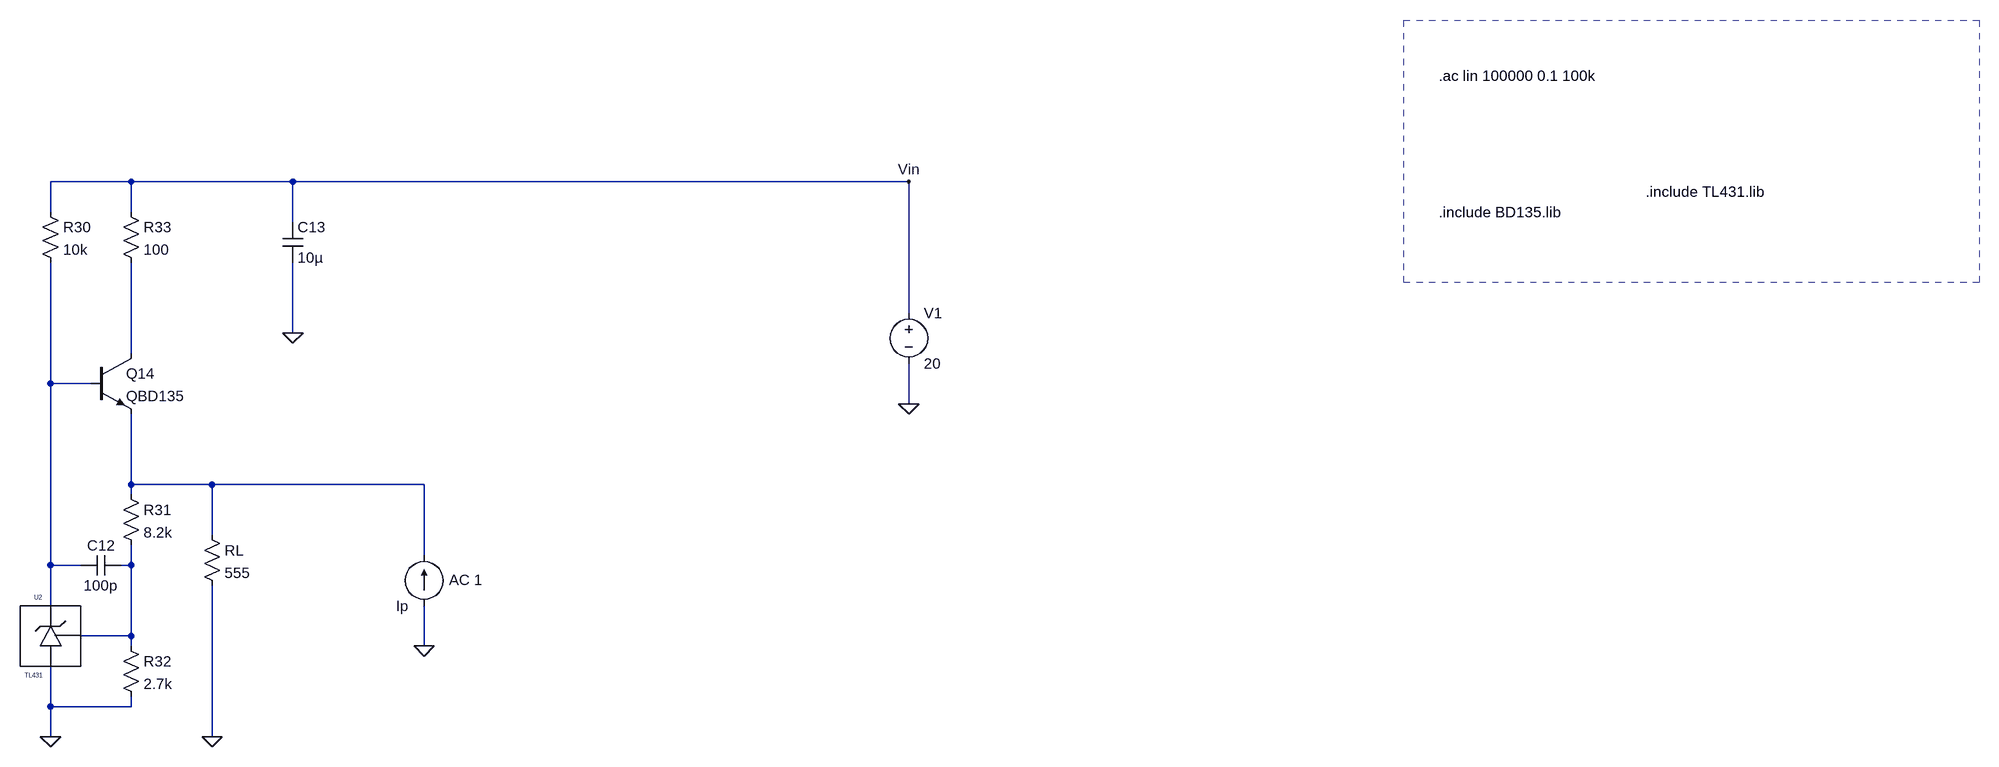
[diagram p0: schematic VREFERENCE_Ro.asc]
VREFERENCE_Ro.asc, the LTspice schematic file:
Version 4
SHEET 1 3040 1240
WIRE -1200 -752 -1328 -752
WIRE -944 -752 -1200 -752
WIRE 32 -752 -944 -752
WIRE -1328 -704 -1328 -752
WIRE -1200 -704 -1200 -752
WIRE -944 -688 -944 -752
WIRE 32 -544 32 -752
WIRE -944 -512 -944 -624
WIRE -1200 -480 -1200 -624
WIRE -1328 -432 -1328 -624
WIRE -1264 -432 -1328 -432
WIRE 32 -400 32 -464
WIRE -1200 -272 -1200 -384
WIRE -1072 -272 -1200 -272
WIRE -736 -272 -1072 -272
WIRE -1200 -256 -1200 -272
WIRE -1072 -192 -1072 -272
WIRE -736 -160 -736 -272
WIRE -1328 -144 -1328 -432
WIRE -1280 -144 -1328 -144
WIRE -1200 -144 -1200 -176
WIRE -1200 -144 -1216 -144
WIRE -1328 -80 -1328 -144
WIRE -1200 -32 -1200 -144
WIRE -1200 -32 -1280 -32
WIRE -1200 -16 -1200 -32
WIRE -736 -16 -736 -80
WIRE -1328 80 -1328 16
WIRE -1200 80 -1200 64
WIRE -1200 80 -1328 80
WIRE -1328 128 -1328 80
WIRE -1072 128 -1072 -112
FLAG -944 -512 0
FLAG -1328 128 0
FLAG -736 -16 0
FLAG 32 -400 0
FLAG 32 -752 Vin
FLAG -1072 128 0
DATAFLAG -1328 -432 ""
DATAFLAG -1200 -544 ""
DATAFLAG -1200 -304 "-Ie(Q14)"
DATAFLAG -1328 -224 "Ix(U2:CATHODE)"
DATAFLAG -960 -272 ""
SYMBOL cap -960 -688 R0
SYMATTR InstName C13
SYMATTR Value 10µ
SYMBOL res -1344 -720 R0
SYMATTR InstName R30
SYMATTR Value 10k
SYMBOL npn -1264 -480 R0
SYMATTR InstName Q14
SYMATTR Value QBD135
SYMBOL res -1216 -272 R0
SYMATTR InstName R31
SYMATTR Value 8.2k
SYMBOL res -1216 -32 R0
SYMATTR InstName R32
SYMATTR Value 2.7k
SYMBOL cap -1216 -160 R90
WINDOW 0 0 32 VBottom 2
WINDOW 3 32 32 VTop 2
SYMATTR InstName C12
SYMATTR Value 100p
SYMBOL TL431 -1328 -32 M0
SYMATTR InstName U2
SYMBOL res -1088 -208 R0
SYMATTR InstName RL
SYMATTR Value 555
SYMBOL res -1216 -720 R0
SYMATTR InstName R33
SYMATTR Value 100
SYMBOL current -736 -80 R180
WINDOW 123 -93 41 Left 2
WINDOW 39 0 0 Left 0
SYMATTR Value2 AC 1
SYMATTR InstName Ip
SYMATTR Value ""
SYMBOL voltage 32 -560 R0
SYMATTR InstName V1
SYMATTR Value 20
TEXT 872 -704 Left 2 !.include BD135.lib
TEXT 1200 -736 Left 2 !.include TL431.lib
TEXT 872 -920 Left 2 !.ac lin 100000 0.1 100k
RECTANGLE Normal 1728 -592 816 -1008 1

The netlist it stands for:
* VREFERENCE_Ro.asc
C13 Vin 0 10µ
R30 Vin N002 10k
Q14 N001 N002 N003 0 QBD135
R31 N003 N004 8.2k
R32 N004 0 2.7k
C12 N004 N002 100p
XU2 N002 0 N004 TL431  ; pins CATHODE ANODE REF
RL N003 0 555
R33 Vin N001 100
Ip 0 N003 AC 1
V1 Vin 0 20
.model NPN NPN
.model PNP PNP
.lib standard.bjt
.include BD135.lib
.include TL431.lib
.ac lin 100000 0.1 100k
.lib tl431.lib
.backanno
.end